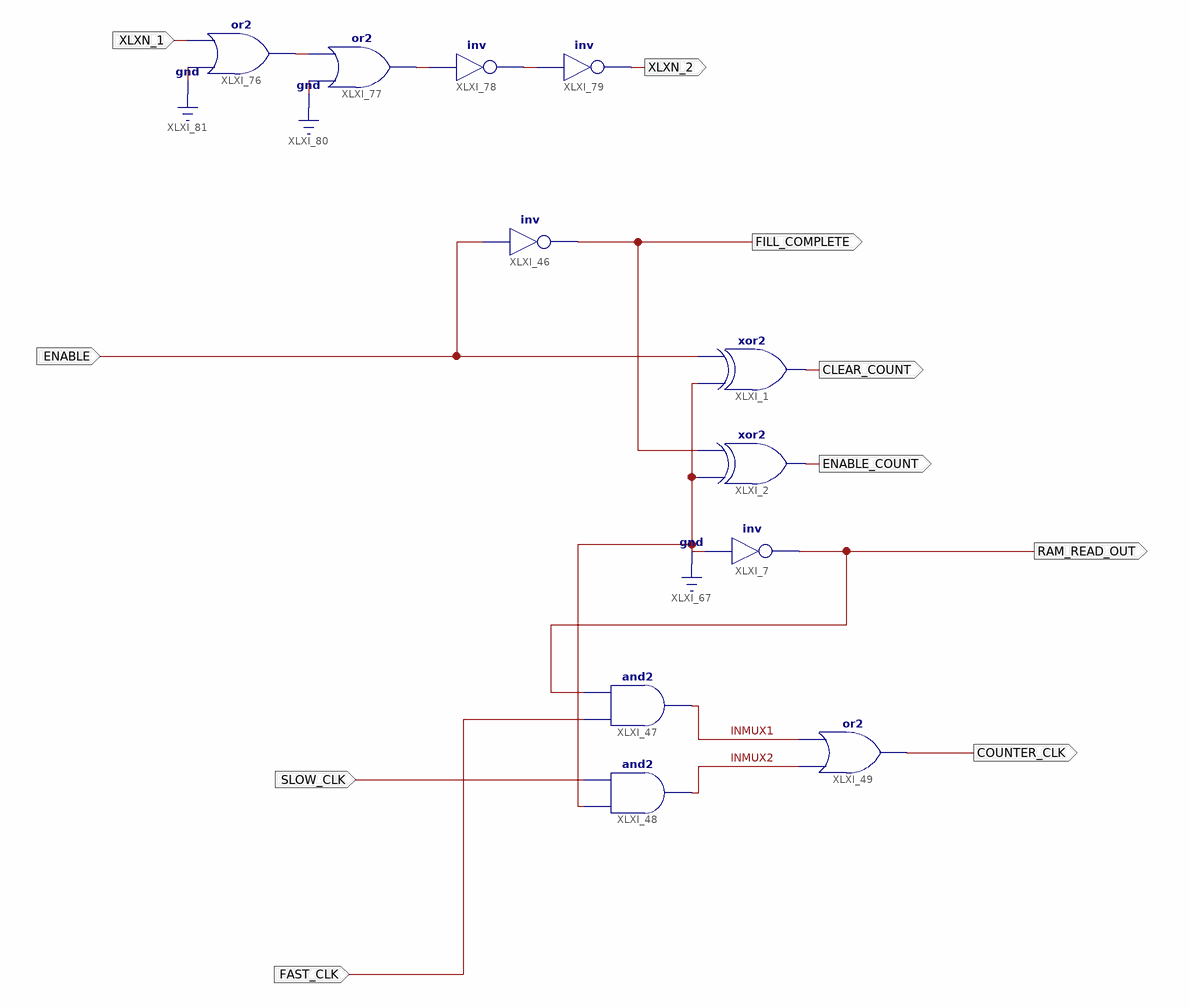
[diagram p0: schematic sheet 1]
// Xilinx ISE schematic ram_read.sch (xc9500xl) as structural Verilog: 11 symbols, 10 ports
module ram_read (
  input  XLXN_1,
  input  SLOW_CLK,
  input  ENABLE,
  input  FAST_CLK,
  output XLXN_2,
  output RAM_READ_OUT,
  output CLEAR_COUNT,
  output ENABLE_COUNT,
  output FILL_COMPLETE,
  output COUNTER_CLK
);

  wire INMUX1, INMUX2, XLXN_119, XLXN_120, XLXN_121;

  or XLXI_76 (XLXN_119, 1'b0, XLXN_1);
  or XLXI_77 (XLXN_120, 1'b0, XLXN_119);
  not XLXI_78 (XLXN_121, XLXN_120);
  not XLXI_79 (XLXN_2, XLXN_121);
  xor XLXI_1 (CLEAR_COUNT, 1'b0, ENABLE);
  xor XLXI_2 (ENABLE_COUNT, 1'b0, FILL_COMPLETE);
  not XLXI_7 (RAM_READ_OUT, 1'b0);
  and XLXI_47 (INMUX1, FAST_CLK, RAM_READ_OUT);
  and XLXI_48 (INMUX2, 1'b0, SLOW_CLK);
  or XLXI_49 (COUNTER_CLK, INMUX2, INMUX1);
  not XLXI_46 (FILL_COMPLETE, ENABLE);
endmodule
